# EAGLE design UART-to-ESP32-WROOM (EAGLE 9.6.2)
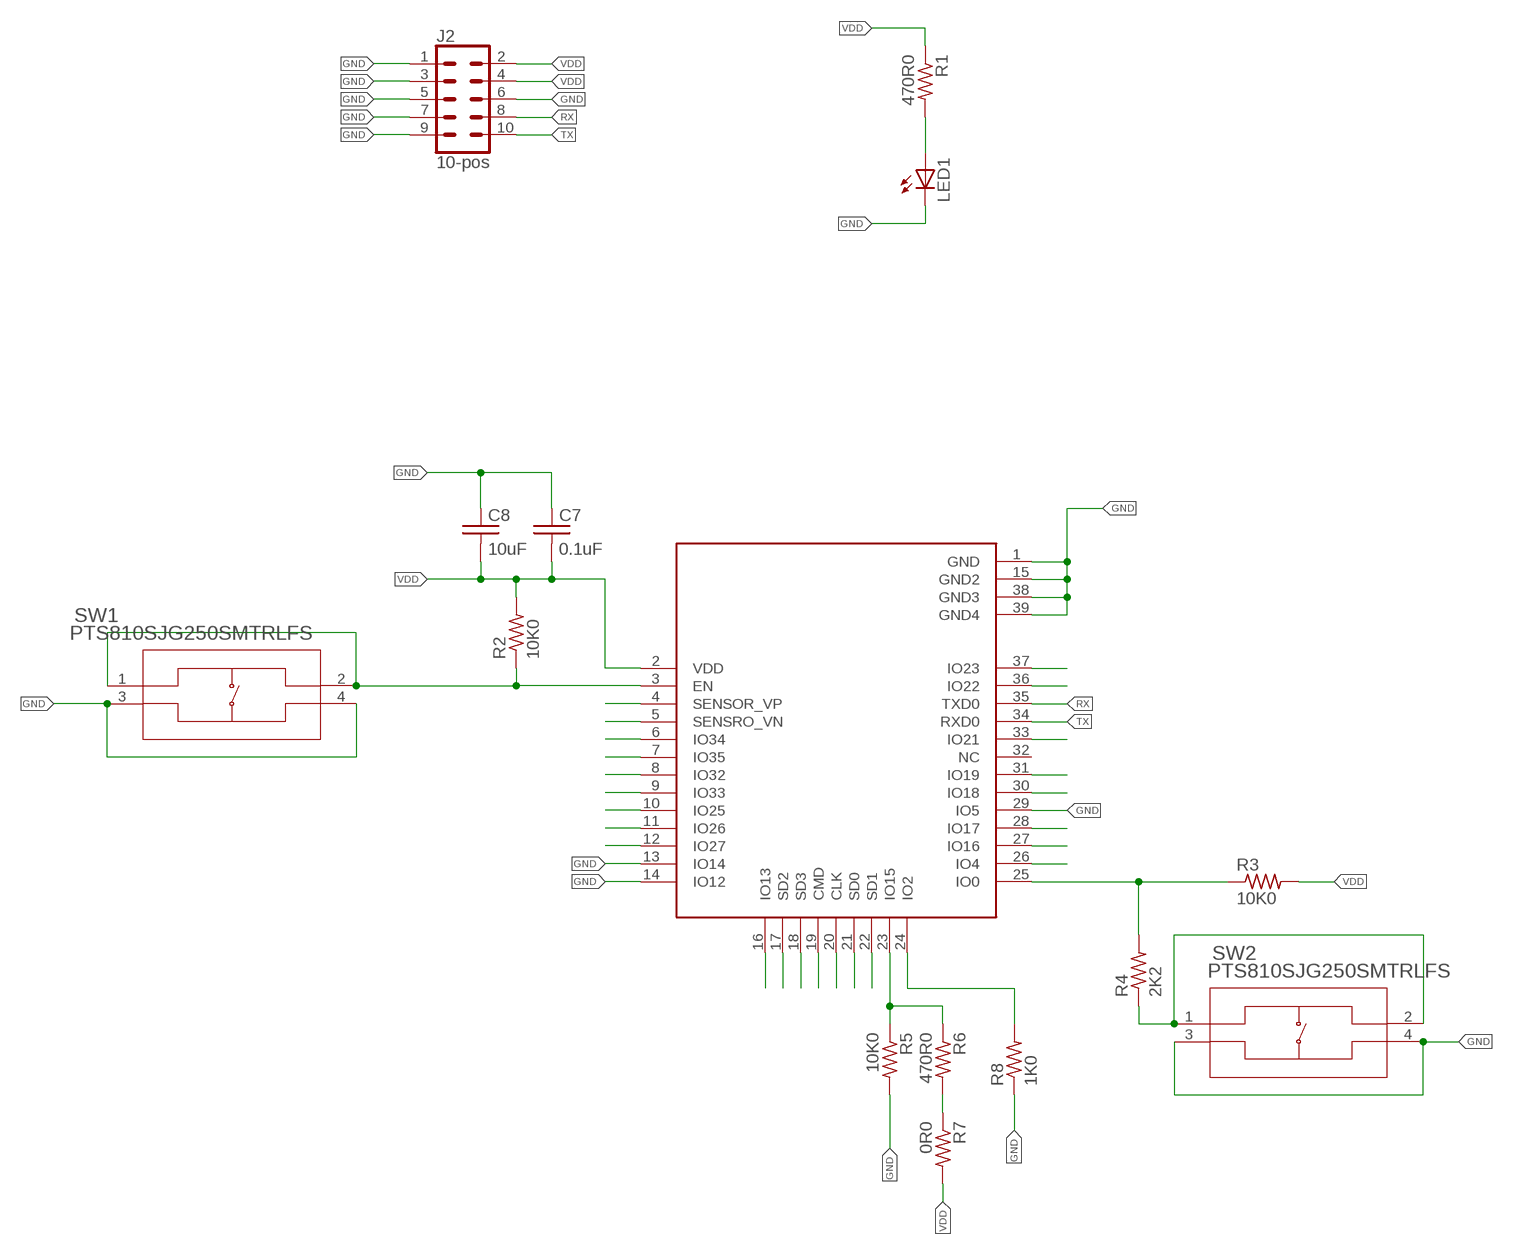
[diagram p0: schematic, sheet 1]

## Parts
C7  0.1uF  C_0402_0.1UF  [0402]
C8  10uF  C_0402_10UF  [0402]
J2  10-pos  CONN_05X2_RAPTH  [2X5]
LED1  Green  LED_0805_GREEN  [LED_0805_GREEN]
R1  470R0  R_0402_470R0  [0402]
R2  10K0  R_0402_10K0  [0402]
R3  10K0  R_0402_10K0  [0402]
R4  2K2  R_0402_2K2  [0402]
R5  10K0  R_0402_10K0  [0402]
R6  470R0  R_0402_470R0  [0402]
R7  0R0  R_0402  [0402]
R8  1K0  R_0402_1K0  [0402]
SW1  PTS810SJG250SMTRLFS  [PTS810]
SW2  PTS810SJG250SMTRLFS  [PTS810]
U2  ESP32-WROOM-32D  [ESP32-WROOM-32D]

## Nets
CHIP_PU: R2.P$1 SW1.1 SW1.2 U2.3(EN)
GND: C7.P$1 C8.P$1 J2.1 J2.3 J2.5 J2.6 J2.7 J2.9 LED1.C R5.P$2 R8.P$1 SW1.3 SW1.4 SW2.3 SW2.4 U2.1(GND) U2.13(IO14) U2.14(IO12) U2.15(GND2) U2.29(IO5) U2.38(GND3) U2.39(GND4)
N$1: LED1.A R1.P$2
N$2: R5.P$1 R6.P$1 U2.23(IO15)
N$3: R4.P$1 SW2.1 SW2.2
N$4: R6.P$2 R7.P$1
N$6: U2.4(SENSOR_VP)
N$7: U2.5(SENSRO_VN)
N$8: U2.6(IO34)
N$9: U2.7(IO35)
N$10: U2.8(IO32)
N$11: U2.9(IO33)
N$12: U2.10(IO25)
N$13: U2.11(IO26)
N$14: U2.12(IO27)
N$17: U2.16(IO13)
N$18: U2.17(SD2)
N$19: U2.18(SD3)
N$20: U2.19(CMD)
N$21: U2.20(CLK)
N$22: U2.21(SD0)
N$23: U2.22(SD1)
N$25: R8.P$2 U2.24(IO2)
N$26: R3.P$1 R4.P$2 U2.25(IO0)
N$27: U2.26(IO4)
N$28: U2.27(IO16)
N$29: U2.28(IO17)
N$31: U2.30(IO18)
N$32: U2.31(IO19)
N$33: U2.33(IO21)
N$36: U2.36(IO22)
N$37: U2.37(IO23)
RX: J2.8 U2.35(TXD0)
TX: J2.10 U2.34(RXD0)
VDD: C7.P$2 C8.P$2 J2.2 J2.4 R1.P$1 R2.P$2 R3.P$2 R7.P$2 U2.2(VDD)
Unconnected: U2.32(NC)

## Library data of the parts
C7 = 3D_MIG_Controller:C_0402_0.1UF; PARTNO: CL05F104ZO5NNNC
C8 = 3D_MIG_Controller:C_0402_10UF; PARTNO: CL05A106MP8NUB8
J2 = 3D_MIG_Controller:CONN_05X2_RA: Connector Header Through Hole, Right Angle 10 position 0.100" (2.54mm); PARTNO: PH2RA-10-UA
LED1 = 3D_MIG_Controller:LED_0805_GREEN: Green 570nm LED Indication - Discrete 2.2V 0805 (2012 Metric); PARTNO: LG R971-KN-1
R1 R6 = 3D_MIG_Controller:R_0402_470R0; PARTNO: RMCF0402JT470R
R2 R3 R5 = 3D_MIG_Controller:R_0402_10K0; PARTNO: RMCF0402JT10K0
R4 = 3D_MIG_Controller:R_0402_2K2; PARTNO: RMCF0402JT2K20
R7 = 3D_MIG_Controller:R_0402
R8 = 3D_MIG_Controller:R_0402_1K0; PARTNO: CRG0402J1K0
SW1 SW2 = 3D_MIG_Controller:PTS810SJG250SMTRLFS; BUILT_BY: EMA_Cory; COPYRIGHT: Copyright (C) 2018 Accelerated Designs. All rights reserved; DATASHEET: https://www.ckswitches.com/products/tactile/PTS810/#PTS810SJG250SMTRLFS; MANUFACTURER_PART_NUMBER: PTS810SJG250SMTRLFS; VENDOR: C&K
U2 = 3D_MIG_Controller:ESP32-WROOM-32D; PARTNO: ESP32-WROOM-32D

## Board
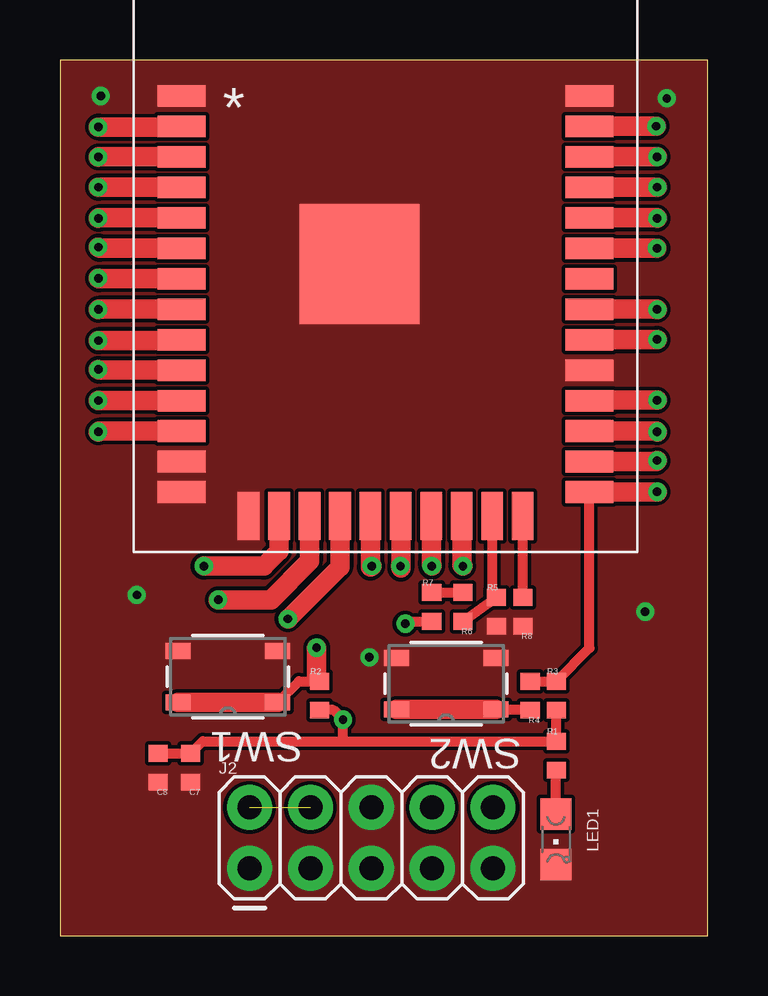
[diagram p1: board, top side]
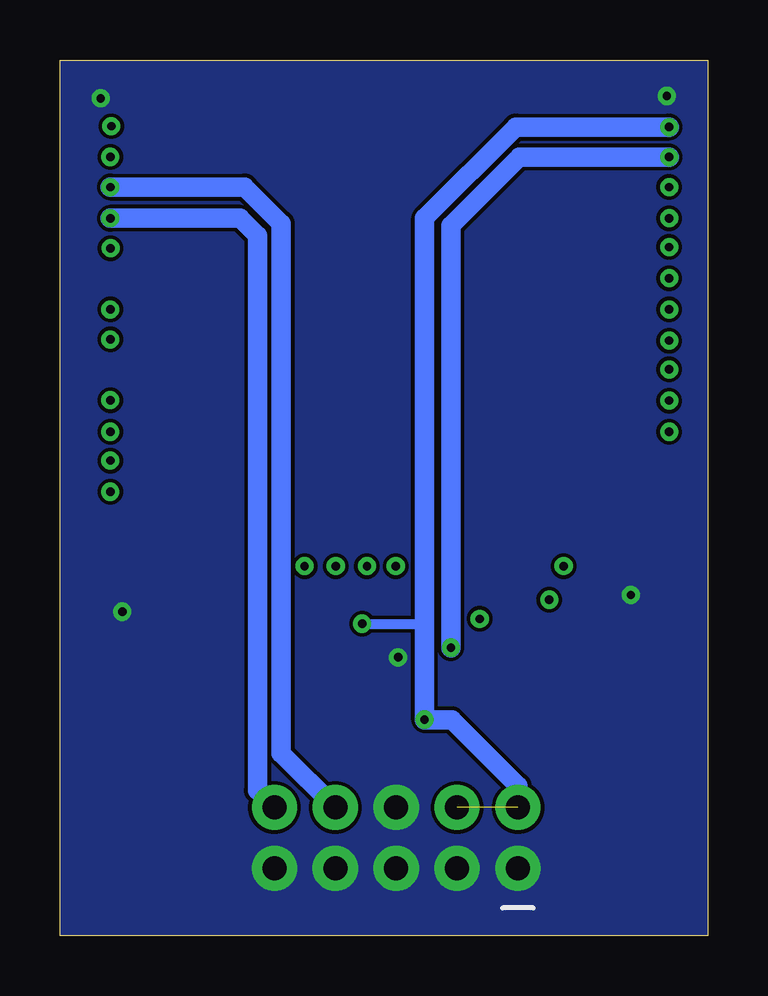
[diagram p2: board, bottom side, seen from below]

Size 27 x 36.5 mm. Coordinates in mm from the lower left corner, seen from the top.
Outline: 0,0 27,0 27,36.5 0,36.5 0,0
Copper layers (1*16): Top 0.035mm / dielectric 1.5mm / Bottom 0.035mm
Design rules "default *": minimum track width 6mil, minimum drill 0.35mm, track to track 6mil, track to pad 6mil, pad to pad 6mil, via to via 6mil, smd to smd 6mil, copper to edge 1mil, drill to drill 6mil, minimum pad ring 10mil, minimum via ring 8mil, stop-mask expansion 4mil, vias tented up to drill 0mil, thermal gap 10mil

### Footprints (pad centres in the part's own frame; a part is rotated, then mirrored left to right if it is on the bottom)
0402 = smd 0.8 x 0.7: P$1 0,0.6; P$2 0,-0.6
2X5 = drill 1 pad 1.88: 1 0,0; 2 0,2.54; 3 2.54,0; 4 2.54,2.54; 5 5.08,0; 6 5.08,2.54; 7 7.62,0; 8 7.62,2.54; 9 10.16,0; 10 10.16,2.54
LED_0805_GREEN = smd 1.3 x 1.3: A 0,-1.05; C 0,1.05
PTS810 = smd 1.041 x 0.66: 1 -2.075,1.075; 2 2.075,1.075; 3 -2.075,-1.075; 4 2.075,-1.075
ESP32-WROOM-32D = smd 2 x 0.9: 1 0,0; 2 0,-1.27; 3 0,-2.54; 4 0,-3.81; 5 0,-5.08; 6 0,-6.35; 7 0,-7.62; 8 0,-8.89; 9 0,-10.16; 10 0,-11.43; 11 0,-12.7; 12 0,-13.97; 13 0,-15.24; 14 0,-16.51; 25 17,-16.51; 26 17,-15.24; 27 17,-13.97; 28 17,-12.7; 29 17,-11.43; 30 17,-10.16; 31 17,-8.89; 32 17,-7.62; 33 17,-6.35; 34 17,-5.08; 35 17,-3.81; 36 17,-2.54; 37 17,-1.27; 38 17,0 | smd 0.9 x 2: 15 2.785,-17.51; 16 4.055,-17.51; 17 5.325,-17.51; 18 6.595,-17.51; 19 7.865,-17.51; 20 9.135,-17.51; 21 10.405,-17.51; 22 11.675,-17.51; 23 12.945,-17.51; 24 14.215,-17.51 | smd 5 x 5: 39 7.415,-7

### Placement (x,y rotation side)
C7  5.45,7 180 top
C8  4.09,7 180 top
J2  7.9,2.8 0 top
LED1  20.68,4.01 180 top
R1  20.7,7.5 0 top
R2  10.82,10 0 top
R3  20.7,10 0 top
R4  19.6,10 180 top
R5  18.2,13.5 0 top
R6  16.8,13.7 180 top
R7  15.5,13.7 0 top
R8  19.3,13.5 180 top
SW1  7,10.79 180 top
SW2  16.1,10.5 180 top
U2  5.08,35 0 top

### Tracks (layer width: path | path; a pad name or v marks a point on that pad's centre or on a via)
CHIP_PU  (via drill 0.35)
  Top 0.406: SW1.1 9.96,10.6 R2.P$1 10.7,10.72
  Top 0.813: SW1.2 SW1.1 | v1.6,32.45 v1.61,32.46 U2.3 | v10.7,12 10.7,10.72
  Bottom 0.813: v10.7,12 10.7,29.6 7.85,32.45 v1.6,32.45
GND  (via drill 0.35)
  other vias: 12.9,11.6 1.7,35 3.2,14.2 25.3,34.9 24.4,13.5
  pour Top (no thermals): 0,36.5 27,36.5 27,0 0,0
  pour Bottom (no thermals): 0,36.5 27,36.5 27,0 0,0
N$1
  Top 0.406: LED1.A 20.68,6.88 R1.P$2
N$2
  Top 0.406: R6.P$1 R5.P$1 18.02,14.28 U2.23
N$3
  Top 0.406: SW2.1 19.57,9.43 R4.P$1
  Top 0.813: SW2.2 SW2.1
N$4
  Top 0.406: R7.P$1 R6.P$2
N$6  (via drill 0.35)
  Top 0.813: U2.4 v1.61,31.19 v1.6,31.2
N$7  (via drill 0.35)
  Top 0.813: U2.5 1.62,29.92 v1.6,29.9
N$8  (via drill 0.35)
  Top 0.813: U2.6 1.65,28.65 v1.6,28.7
N$9  (via drill 0.35)
  Top 0.813: U2.7 1.62,27.38 v1.6,27.4
N$10  (via drill 0.35)
  Top 0.813: U2.8 v1.61,26.11 v1.6,26.1
N$11  (via drill 0.35)
  Top 0.813: U2.9 5.04,24.8 v1.6,24.8
N$12  (via drill 0.35)
  Top 0.813: U2.10 1.63,23.57 v1.6,23.6
N$13  (via drill 0.35)
  Top 0.813: U2.11 v1.6,22.3
N$14  (via drill 0.35)
  Top 0.813: U2.12 1.63,21.03 v1.6,21
N$17  (via drill 0.35)
  Top 0.813: U2.16 9.13,16.04 8.5,15.4 v6,15.4
N$18  (via drill 0.35)
  Top 0.813: U2.17 10.4,15.61 8.8,14 v6.6,14
N$19  (via drill 0.35)
  Top 0.813: U2.18 11.68,15.38 v9.5,13.2
N$20  (via drill 0.35)
  Top 0.813: U2.19 12.95,15.36 v13,15.4
N$21  (via drill 0.35)
  Top 0.813: U2.20 14.21,15.31 v14.2,15.4
N$22  (via drill 0.35)
  Top 0.813: U2.21 15.48,15.52 v15.5,15.4
N$23  (via drill 0.35)
  Top 0.813: U2.22 16.75,15.45 v16.8,15.4
N$25
  Top 0.406: R8.P$2 U2.24
N$26  (via drill 0.35)
  Top 0.406: R4.P$2 R3.P$1 22.08,11.98 U2.25
  Top 0.813: U2.25 v24.89,18.49 v24.9,18.5
N$27  (via drill 0.35)
  Top 0.813: U2.26 24.86,19.76 v24.9,19.8
N$28  (via drill 0.35)
  Top 0.813: U2.27 24.87,21.03 v24.9,21
N$29  (via drill 0.35)
  Top 0.813: U2.28 22.1,22.32 v24.9,22.32
N$31  (via drill 0.35)
  Top 0.813: U2.30 v24.89,24.84 v24.9,24.85
N$32  (via drill 0.35)
  Top 0.813: U2.31 v24.89,26.11 v24.9,26.1
N$33  (via drill 0.35)
  Top 0.813: U2.33 v24.89,28.65
N$36  (via drill 0.35)
  Top 0.813: U2.36 v24.9,32.46
N$37  (via drill 0.35)
  Top 0.813: U2.37 v24.85,33.73 v24.86,33.74
RX  (via drill 0.35)
  Top 0.813: U2.35 v24.89,31.19 v24.9,31.2
  Bottom 0.813: v24.9,31.2 19.3,31.2 17.78,29.68 17.78,7.6 J2.8
TX  (via drill 0.35)
  Top 0.813: U2.34 24.88,29.92 v24.9,29.9
  Bottom 0.813: J2.10 18.77,6.05 18.77,29.17 19.5,29.9 v24.9,29.9
VDD  (via drill 0.35)  (1 unrouted)
  Top 0.406: 11.8,8.1 5.95,8.1 C7.P$2 C8.P$2 | 11.8,8.1 R1.P$1 R3.P$2 | 11.8,8.1 v11.8,9 11.4,9.4 R2.P$2 | v14.4,13 14.5,13.1 R7.P$2
  Top 0.813: v1.6,33.7 5.05,33.7 U2.2
  Bottom 0.406: v11.8,9 11.8,13 v14.4,13
  Bottom 0.813: J2.2 7.9,6.24 10.66,9 v11.8,9 11.8,29.9 8,33.7 v1.6,33.7